# Altium schematic sheet Positive_Output.SchDoc
size A; SheetNumber: 4; SheetTotal: 8
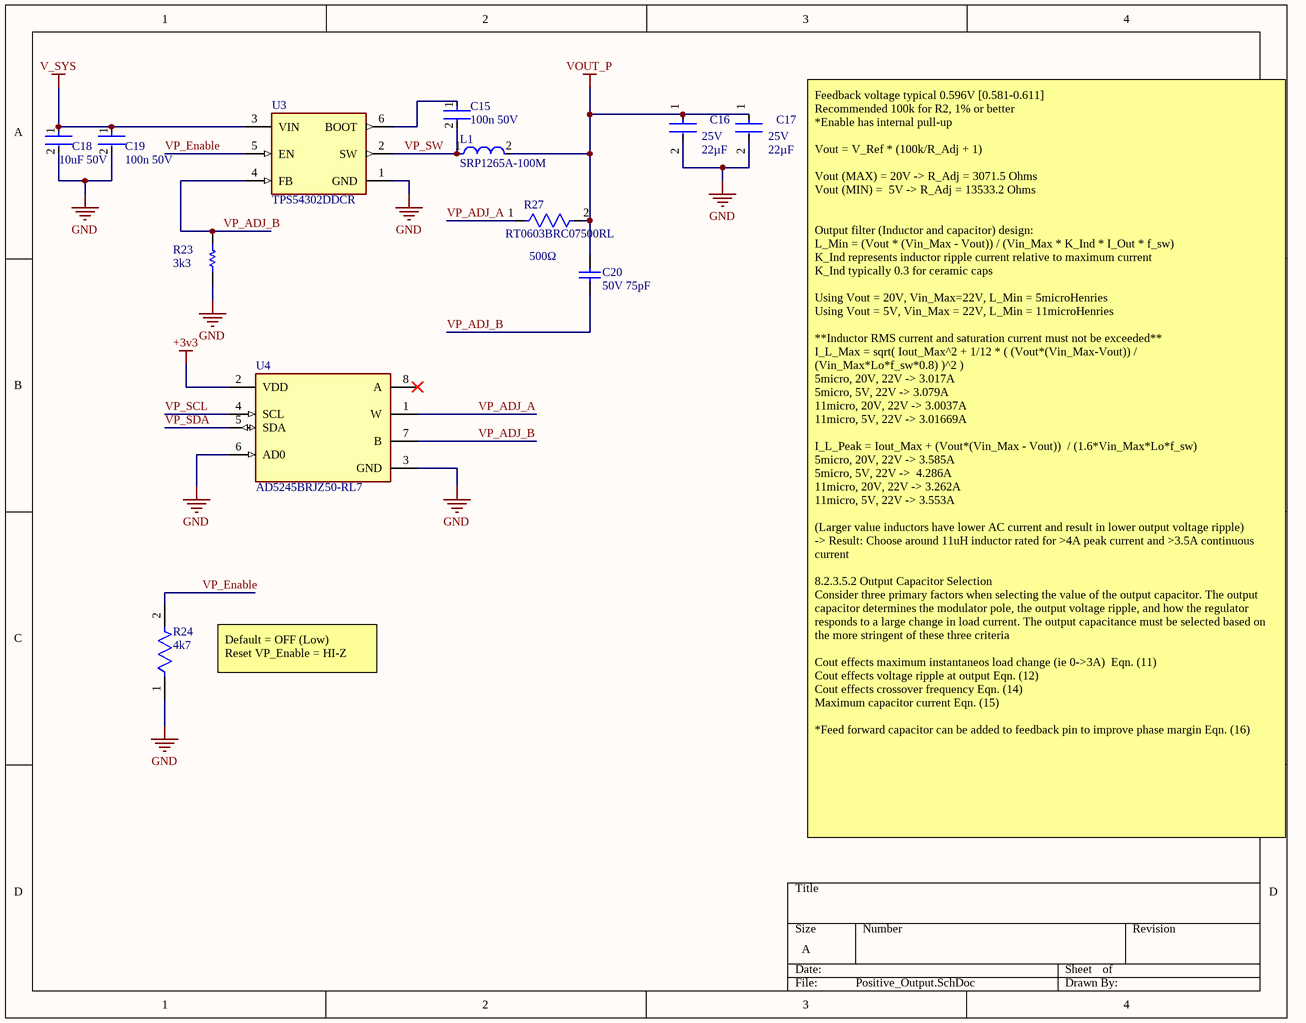
[diagram p0: Positive_Output.SchDoc]

## Parts
C15  100n 50V  [FP-C0603C-CF-MFG]
C16  CL31A226KAHNNNE  [CL31H-0_2_MFG]  (value not drawn)
C17  CL31A226KAHNNNE  [CL31H-0_2_MFG]  (value not drawn)
C18  10uF 50V  [FP-CL31-IPC_C]
C19  100n 50V  [FP-C0603C-CF-MFG]
C20  50V 75pF  [CAPC1608X90X35ML15T15]
L1  SRP1265A-100M  [FP-SRP1265A-100M-MFG]
R23  3k3  [RESC0603(1608)_N]
R24  4k7  [FP-AC0603-IPC_A]
R27  RT0603BRC07500RL  [RESC16080X45_RT0603-0_55_MFG]
U3  TPS54302DDCR  [FP-DDC0006A-MFG]
U4  AD5245BRJZ50-RL7  [FP-RJ-8-IPC_A]

## Nets
+3v3: U4.2(VDD)
GND: C16.2 C17.2 C18.2 C19.2 R23.1 R24.1 U3.1(GND) U4.3(GND) U4.6(AD0)
V_SYS: C18.1 C19.1 U3.3(VIN)
VOUT_P: C16.1 C17.1 C20.2 L1.2 R27.2
VP_ADJ_A: R27.1 U4.1(W)
VP_ADJ_B: C20.1 R23.2 U3.4(FB) U4.7(B)
VP_Enable: R24.2 U3.5(EN)
VP_SCL: U4.4(SCL)
VP_SDA: U4.5(SDA)
VP_SW: C15.2 L1.1 U3.2(SW)
NetC15_1: C15.1 U3.6(BOOT)

Not connected (* = marked no-connect by the designer): U4 8(A)*

## Notes on the sheet
- (near R24) Default = OFF (Low)
  Reset VP_Enable = HI-Z
- Feedback voltage typical 0.596V [0.581-0.611]
  Recommended 100k for R2, 1% or better
  *Enable has internal pull-up
  Vout = V_Ref * (100k/R_Adj + 1)
  Vout (MAX) = 20V -> R_Adj = 3071.5 Ohms
  Vout (MIN) =  5V -> R_Adj = 13533.2 Ohms
  Output filter (Inductor and capacitor) design:
  L_Min = (Vout * (Vin_Max - Vout)) / (Vin_Max * K_Ind * I_Out * f_sw)
  K_Ind represents inductor ripple current relative to maximum current
  K_Ind typically 0.3 for ceramic caps
  Using Vout = 20V, Vin_Max=22V, L_Min = 5microHenries
  Using Vout = 5V, Vin_Max = 22V, L_Min = 11microHenries
  **Inductor RMS current and saturation current must not be exceeded**
  I_L_Max = sqrt( Iout_Max^2 + 1/12 * ( (Vout*(Vin_Max-Vout)) /			     		  		 (Vin_Max*Lo*f_sw*0.8) )^2 )
  5micro, 20V, 22V -> 3.017A
  5micro, 5V, 22V -> 3.079A
  11micro, 20V, 22V -> 3.0037A
  11micro, 5V, 22V -> 3.01669A
  I_L_Peak = Iout_Max + (Vout*(Vin_Max - Vout))  / (1.6*Vin_Max*Lo*f_sw)
  5micro, 20V, 22V -> 3.585A
  5micro, 5V, 22V ->  4.286A
  11micro, 20V, 22V -> 3.262A
  11micro, 5V, 22V -> 3.553A
  (Larger value inductors have lower AC current and result in lower output voltage ripple)
  -> Result: Choose around 11uH inductor rated for >4A peak current and >3.5A continuous current
  8.2.3.5.2 Output Capacitor Selection
  Consider three primary factors when selecting the value of the output capacitor. The output capacitor determines the modulator pole, the output voltage ripple, and how the regulator responds to a large change in load current. The output capacitance must be selected based on the more stringent of these three criteria
  Cout effects maximum instantaneos load change (ie 0->3A)  Eqn. (11)
  Cout effects voltage ripple at output Eqn. (12)
  Cout effects crossover frequency Eqn. (14)
  Maximum capacitor current Eqn. (15)
  *Feed forward capacitor can be added to feedback pin to improve phase margin Eqn. (16)

## Library data of the parts
C15 C19 = CMP-2006-03061-2: CAP CER 0.1UF 50V X7R 0603; Manufacturer: KEMET; Manufacturer Part Number: C0603C104K5RACTU; Tolerance: 0.1; Temperature Coefficient: 30ppm/°C; Material: Ceramic; Automotive Grade: Grade 1; Value: 0.10 μF; Temperature: -55°C to +125°C; RoHS: TRUE; Temperature Range High: +125°C; Lead Free: Yes; Octopart: https://octopart.com/c0603c104k5ractu-kemet-139244; Digikey Description: CAP CER 0.1UF 50V X7R 0603; Category: Cap; Package: C0603C-CF; ComponentLink2Description: Datasheet; Temperature Range Low: -55°C; Device Class L1: Passive Components; Voltage Rating: 50 V; Automotive: Yes; Device Class L3: Ceramic Capacitors; ComponentLink2URL: https://api.kemet.com/component-edge/download/datasheet/C0603C100J5GACAUTO.pdf; Capacitance: 0.10 μF; Device Class L2: Capacitors; Temperature Characteristic: X7R; Height: 0.87mm
C16 C17 = CMP-13271-000012-2: Ceramic Capacitor, Multilayer, Ceramic, 25V, 10% +Tol, 10% -Tol, X5R, 15% TC, 22uF, Surface Mount, 1206; Capacitance: 22µF; Material: Ceramic; RoHS: Compliant; Dielectric: X5R; HelpURL: https://product.samsungsem.com/mlcc/CL31A226KAHNNN.do; Max Operating Temperature: 85°C; Tolerance: 10%; Voltage Rating (DC): 25V; ComponentLink2Description: Datasheet URL; Voltage Rating: 25V; Min Operating Temperature: -55°C; ComponentLink2URL: https://product.samsungsem.com/mlcc/CL31A226KAHNNN.do; Case/Package: 1206; Height: 1.8mm
C18 = CMP-13271-000016-1: CAP CER 10UF 50V X5R 1206; Manufacturer: Samsung; Manufacturer Part Number: CL31A106KBHNNNE; Tolerance: 10%; Material: Ceramic; Temperature Coefficient: 15%; RoHS: TRUE; Ipc Land Pattern Name: CAPC320160X160; Temperature Range Low: -55°C; Value: 10uF; Device Class L3: Ceramic Capacitors; Category: Cap; Temperature Characteristic: X5R; Lead Free: Yes; Device Class L2: Capacitors; Octopart: https://octopart.com/cl31a106kbhnnne-samsung-19832778; ComponentLink2Description: Datasheet; Digikey Description: CAP CER 10UF 50V X5R 1206; Voltage: 50V; ComponentLink2URL: http://www.samsungsem.com/kr/support/product-search/mlcc/__icsFiles/afieldfile/2018/06/21/CL31A106KBHNNNE.pdf; Capacitance: 10uF; Temperature Range High: +85°C; Device Class L1: Passive Components; Height: 1.8mm; Automotive: No; Voltage Rating: 50V; Package: CL31; Temperature: -55°C to +85°C
C20 = CMP-2006-04358-1: Part Number: 06035A750JAT2A; Manufacturer: AVX Interconnect / Elco
L1 = CMP-07248-000069-1: FIXED IND 10UH 10A 16.5 MOHM SMD; Shielding: Shielded; Self Resonant Frequency: 10MHz; Test Frequency: 100kHz; Q Factor: 20; Saturation Current: 15.5A; Tolerance: 20%; Core Material: Carbonyl Powder; DC Resistance (DCR): 16.5mR; REACH SVHC: No SVHC; Case/Package: Nonstandard; Length: 13.5mm; RMS Current (Irms): 10A; Termination: SMD/SMT; Max DC Current: 10A; Ratings: AEC-Q200; Max Operating Temperature: 150°C; Height: 6.2mm; Resistor Type: Wirewound; Min Operating Temperature: -40°C; Mount: Surface Mount; Packaging: Cut Tape; Depth: 12.5mm; Package Quantity: 500; RoHS Compliant: Yes; Current Rating: 10A; Inductance Tolerance: 20%; Width: 0.492inch; Height - Seated (Max): 0.252inch; Inductance: 10uH
R23 = CMP-1012-00736-1: 100K 0.1W 1% 0603 (1608 Metric)  SMD; Value: 100000.00 Ohm; Case-Metric: 1608; Case-EIA: 0603; Power: 0.1 W; Tolerance: 1 %; Technology: SMT
R24 = CMP-03412-006483-2: RES 4.7KΩ 1.00% 0.1W 0603; Tolerance: 1%; Resistance: 4.7kR; Case/Package: 0603; RoHS Compliant: Yes
R27 = CMP-00621-87214386-1: Fixed Resistor, Thin Film, 0.1W, 500ohm, 75V, 0.1% +/-Tol, 15ppm/Cel, Surface Mount, 0603; Temperature Coefficient: 15ppm/°C; Power Rating: 100mW; Resistance: 500Ω; ComponentLink1URL: http://www.yageo.com/; Min Operating Temperature: -55°C; ComponentLink1Description: Manufacturer URL; Tolerance: 0.1%; ComponentLink3URL: http://www.yageo.com/exep/pages/download/literatures/PYu-R_Mount_10.pdf; RoHS: Non-Compliant; Voltage Rating: 75V; Max Operating Temperature: 155°C; Height: 550µm; ComponentLink2URL: https://www.yageo.com/upload/media/product/productsearch/datasheet/rchip/PYu-RT_1-to-0.01_RoHS_L_15.pdf; Case/Package: 0603; Packaging: Tape & Reel; ComponentLink3Description: Package URL; Composition: Thin Film; ComponentLink2Description: Datasheet URL
U3 = CMP-04918-000032-1: IC REG BUCK ADJ 3A TSOT23-6; Manufacturer: Texas Instruments; Output Voltage: 0.6-26V; Output Type: AdjustableProgrammable; Max Junction Temp: +125°C; Number Of Outputs: 1; Min Supply Voltage: 4.5V; Switching Frequency: 400kHz; Standoff Height: 0mm; Max Duty Cycle: 100%; Nominal Supply Current: 45uA; Max Supply Voltage: 28V; Temperature Range High: +125°C; Switching Topology: Buck; Device Class L2: Power Management ICs; Output Current: 3A; Automotive: No; Temperature Range Low: -40°C; Temperature: -40°C to +125°C; Height: 1.1mm; Ipc Land Pattern Name: SOT95P280X110-6; RoHS: TRUE; Digikey Description: IC REG BUCK ADJ 3A TSOT23-6; Manufacturer Part Number: TPS54302DDCR; ComponentLink2Description: Datasheet; Device Class L3: Voltage Regulators - Switching; Octopart: https://octopart.com/tps54302ddcr-texas+instruments-74209025; Device Class L1: Integrated Circuits (ICs); Lead Free: Yes; ComponentLink2URL: http://www.ti.com/lit/ds/symlink/tps54302.pdf; Category: IC; Package: DDC0006A
U4 = CMP-09083-000073-1: IC DGT POT 50KOHM 256TAP SOT23-8; Operating Supply Voltage: 5.5V; Supply Current: 3uA; Memory Type: Volatile; Number of Elements: 1; Resistance: 50kR; Number of Taps: 256; Temperature Coefficient: 35ppm/°C; Resistance Tolerance: 30%; Min Supply Voltage: 2.7V; -3db Bandwidth: 1.2MHz; Interface: I2C; Frequency: 400kHz; Max Supply Voltage: 5.5V; Number of Pins: 8; Package Quantity: 3000; Case/Package: SOT-23; REACH SVHC: No SVHC; Number of Circuits: 1; Taper: Linear; Contact Plating: Gold; Min Operating Temperature: -40°C; Operating Supply Current: 3uA; RoHS Compliant: Yes; Packaging: Tape and Reel; Number of Positions: 256; Lead Free: Contains Lead; Max Supply Current: 3uA; Max Operating Temperature: 125°C; Nominal Supply Current: 3uA; Radiation Hardening: No; Mount: Surface Mount; Tolerance: 30%; Series: -; Quiescent Current: 3uA